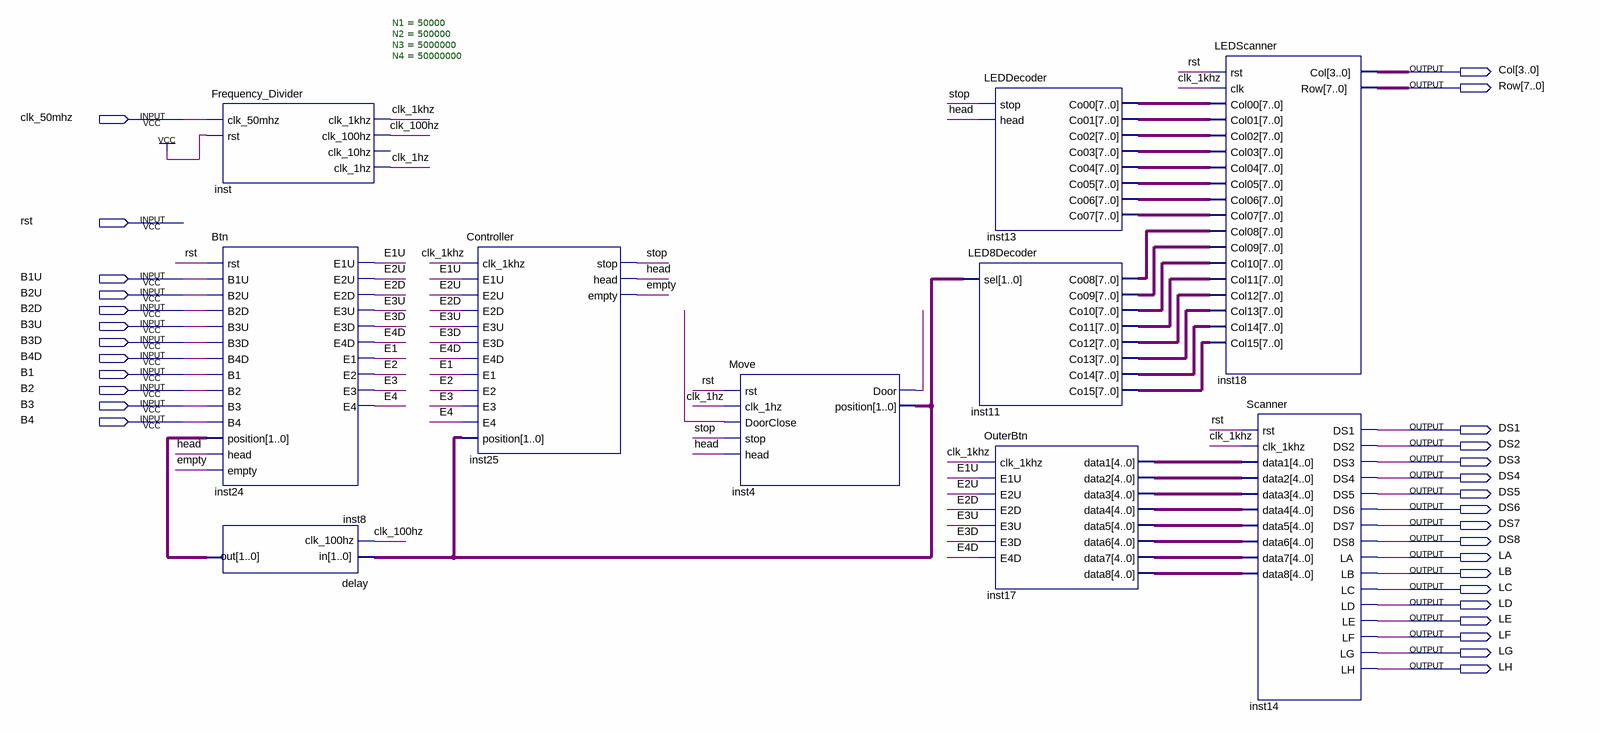
[diagram p0: schematic sheet]
// Quartus schematic Elevator.bdf as structural Verilog: 10 symbols, 30 pins
module Elevator (
  input  clk_50mhz,
  input  rst,
  input  B1U,
  input  B2U,
  input  B2D,
  input  B3U,
  input  B3D,
  input  B4D,
  input  B1,
  input  B2,
  input  B3,
  input  B4,
  output [3:0] Col,
  output [7:0] Row,
  output DS1,
  output DS2,
  output DS3,
  output DS4,
  output DS5,
  output DS6,
  output DS7,
  output DS8,
  output LA,
  output LB,
  output LC,
  output LD,
  output LE,
  output LF,
  output LG,
  output LH
);

  wire clk_1hz, clk_1khz, clk_100hz, E1, E1U, E2, E2D, E2U, E3, E3D, E3U, E4, E4D, empty, head, inst4_door,
       stop, undriven;
  wire [1:0] inst4_position, inst8_out;
  wire [4:0] inst17_data1, inst17_data2, inst17_data3, inst17_data4, inst17_data5, inst17_data6,
       inst17_data7, inst17_data8;
  wire [7:0] inst11_co08, inst11_co09, inst11_co10, inst11_co11, inst11_co12, inst11_co13, inst11_co14,
       inst11_co15, inst13_co00, inst13_co01, inst13_co02, inst13_co03, inst13_co04, inst13_co05,
       inst13_co06, inst13_co07;

  Frequency_Divider #(.N1(50000), .N2(500000), .N3(5000000), .N4(50000000)) inst (
    .clk_50mhz(clk_50mhz), .rst(1'b1), .clk_1khz(clk_1khz), .clk_100hz(clk_100hz), .clk_1hz(clk_1hz));  // open: clk_10hz
  Btn inst24 (
    .rst(rst), .B1U(B1U), .B2U(B2U), .B2D(B2D), .B3U(B3U), .B3D(B3D), .B4D(B4D), .B1(B1), .B2(B2), .B3(B3),
    .B4(B4), .position(inst8_out), .head(head), .empty(empty), .E1U(E1U), .E2U(E2U), .E2D(E2D), .E3U(E3U),
    .E3D(E3D), .E4D(E4D), .E1(E1), .E2(E2), .E3(E3), .E4(E4));
  delay inst8 (.in(inst4_position), .clk_100hz(clk_100hz), .out(inst8_out));
  Controller inst25 (
    .clk_1khz(clk_1khz), .E1U(E1U), .E2U(E2U), .E2D(E2D), .E3U(E3U), .E3D(E3D), .E4D(E4D), .E1(E1), .E2(E2),
    .E3(E3), .E4(E4), .position(inst4_position), .stop(stop), .head(head), .empty(empty));
  Move inst4 (
    .rst(rst), .clk_1hz(clk_1hz), .DoorClose(undriven), .stop(stop), .head(head), .Door(inst4_door),
    .position(inst4_position));
  LED8Decoder inst11 (
    .sel(inst4_position), .Co08(inst11_co08), .Co09(inst11_co09), .Co10(inst11_co10), .Co11(inst11_co11),
    .Co12(inst11_co12), .Co13(inst11_co13), .Co14(inst11_co14), .Co15(inst11_co15));
  LEDDecoder inst13 (
    .stop(stop), .head(head), .Co00(inst13_co00), .Co01(inst13_co01), .Co02(inst13_co02), .Co03(inst13_co03),
    .Co04(inst13_co04), .Co05(inst13_co05), .Co06(inst13_co06), .Co07(inst13_co07));
  OuterBtn inst17 (
    .clk_1khz(clk_1khz), .E1U(E1U), .E2U(E2U), .E2D(E2D), .E3U(E3U), .E3D(E3D), .E4D(E4D),
    .data1(inst17_data1), .data2(inst17_data2), .data3(inst17_data3), .data4(inst17_data4),
    .data5(inst17_data5), .data6(inst17_data6), .data7(inst17_data7), .data8(inst17_data8));
  LEDScanner inst18 (
    .rst(rst), .clk(clk_1khz), .Col00(inst13_co00), .Col01(inst13_co01), .Col02(inst13_co02),
    .Col03(inst13_co03), .Col04(inst13_co04), .Col05(inst13_co05), .Col06(inst13_co06), .Col07(inst13_co07),
    .Col08(inst11_co08), .Col09(inst11_co09), .Col10(inst11_co10), .Col11(inst11_co11), .Col12(inst11_co12),
    .Col13(inst11_co13), .Col14(inst11_co14), .Col15(inst11_co15), .Col(Col), .Row(Row));
  Scanner inst14 (
    .rst(rst), .clk_1khz(clk_1khz), .data1(inst17_data1), .data2(inst17_data2), .data3(inst17_data3),
    .data4(inst17_data4), .data5(inst17_data5), .data6(inst17_data6), .data7(inst17_data7),
    .data8(inst17_data8), .DS1(DS1), .DS2(DS2), .DS3(DS3), .DS4(DS4), .DS5(DS5), .DS6(DS6), .DS7(DS7),
    .DS8(DS8), .LA(LA), .LB(LB), .LC(LC), .LD(LD), .LE(LE), .LF(LF), .LG(LG), .LH(LH));
endmodule
